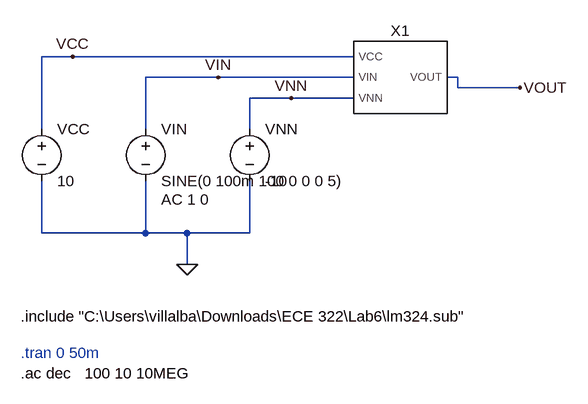
[diagram p0: schematic Lab6.asc]
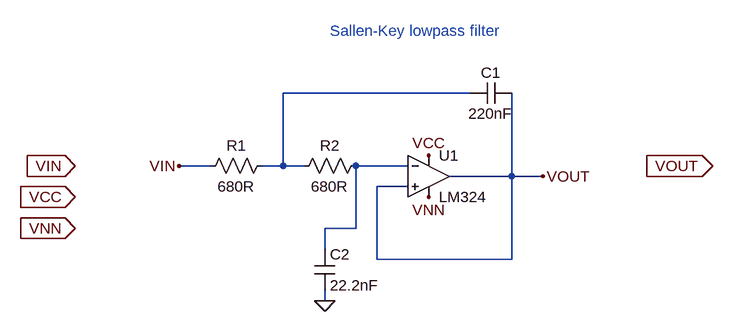
[diagram p1: sub-circuit lab6_alex_villalba.asc]
* Lab6.asc
VCC VCC 0 10
VIN VIN 0 SINE(0 100m 100 0 0 0 5) AC 1 0
VNN VNN 0 -10
XX1 VCC VIN VNN VOUT lab6_alex_villalba

* block symbol definitions
.subckt lab6_alex_villalba VCC VIN VNN VOUT
* U1: LM324 (symbol LM324 not available, pins judged from their places): In+=VOUT In-=N002 V+=VCC V-=VNN OUT=VOUT
R1 N001 VIN 680R
R2 N002 N001 680R
C1 VOUT N001 220nF
C2 N002 0 22.2nF
* Sallen-Key lowpass filter
.ends lab6_alex_villalba

.include "C:\Users\villalba\Downloads\ECE 322\Lab6\lm324.sub"
* .tran 0 50m
.ac dec   100 10 10MEG
.backanno
.end

* Results of the author's LTspice run, read from the files saved beside the schematic
* Operating Point, zero values left out:
*   V(vcc) = 10 V
*   V(vnn) = -10 V
*   V(vout) = -131.7 µV
*   I(Vcc) = -2.217 mA
*   I(Vin) = 44.74 nA
*   I(Vnn) = 2.217 mA
*   Ix(x1:VCC) = 2.217 mA
*   Ix(x1:VIN) = -44.74 nA
*   Ix(x1:VNN) = -2.217 mA
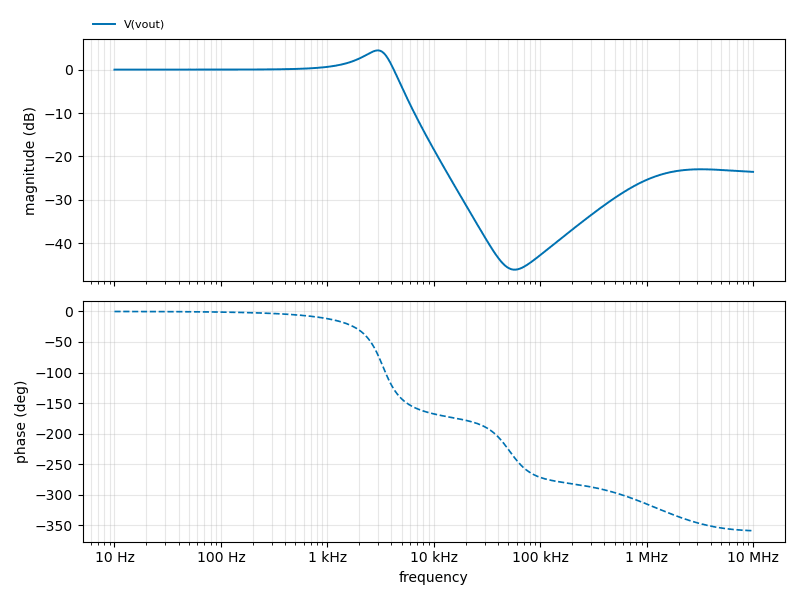
[diagram p2: AC Analysis of Lab6.asc, plotted from the saved traces]
* AC Analysis, 1 run:
*   V(vout): -0.00 dB at 10 Hz, -23.55 dB at 10 MHz, peak 4.43 dB at 2.951 kHz, 3 dB below the peak at 1.486 kHz and 3.94 kHz